# Altium schematic sheet smt preamp with charge or INV stages with input resistors.SchDoc
size A; SheetNumber: 2; SheetTotal: 2
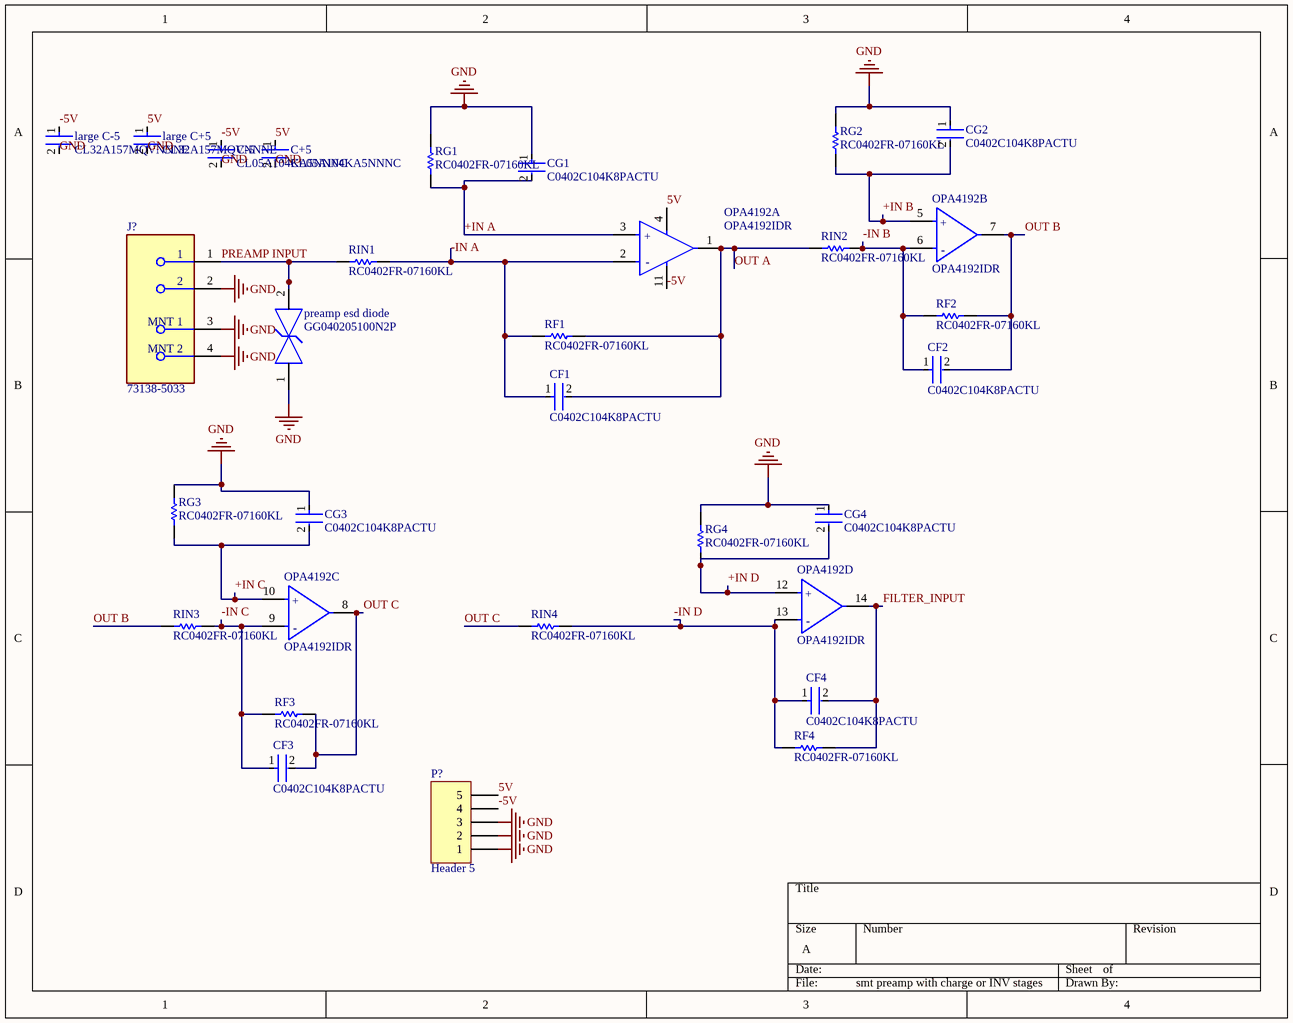
[diagram p0: smt preamp with charge or INV stages with input resistors.SchDoc]

## Parts
C+5  CL05A104KA5NNNC  [FP-CL278-IPC_C]
C-5  CL05A104KA5NNNC  [FP-CL278-IPC_C]
CF1  C0402C104K8PACTU  [FP-C0402-BB-MFG]
CF2  C0402C104K8PACTU  [FP-C0402-BB-MFG]
CF3  C0402C104K8PACTU  [FP-C0402-BB-MFG]
CF4  C0402C104K8PACTU  [FP-C0402-BB-MFG]
CG1  C0402C104K8PACTU  [FP-C0402-BB-MFG]
CG2  C0402C104K8PACTU  [FP-C0402-BB-MFG]
CG3  C0402C104K8PACTU  [FP-C0402-BB-MFG]
CG4  C0402C104K8PACTU  [FP-C0402-BB-MFG]
J?  73138-5033  [FP-73138-5033-MFG]
large_C+5  CL32A157MQVNNNE  [FP-CL32-IPC_C]
large_C-5  CL32A157MQVNNNE  [FP-CL32-IPC_C]
OPA4192  OPA4192IDR  [FP-D0014A-IPC_C]  (parts A,B,C,D of 4)
P?  Header 5  [HDR1X5]
preamp_esd_diode  GG040205100N2P  [FP-GG0402-MFG]
RF1  RC0402FR-07160KL  [RESC1005X40X25NL05T10]
RF2  RC0402FR-07160KL  [RESC1005X40X25NL05T10]
RF3  RC0402FR-07160KL  [RESC1005X40X25NL05T10]
RF4  RC0402FR-07160KL  [RESC1005X40X25NL05T10]
RG1  RC0402FR-07160KL  [RESC1005X40X25NL05T10]
RG2  RC0402FR-07160KL  [RESC1005X40X25NL05T10]
RG3  RC0402FR-07160KL  [RESC1005X40X25NL05T10]
RG4  RC0402FR-07160KL  [RESC1005X40X25NL05T10]
RIN1  RC0402FR-07160KL  [RESC1005X40X25NL05T10]
RIN2  RC0402FR-07160KL  [RESC1005X40X25NL05T10]
RIN3  RC0402FR-07160KL  [RESC1005X40X25NL05T10]
RIN4  RC0402FR-07160KL  [RESC1005X40X25NL05T10]

## Nets
GND: C+5.2 C-5.2 CG1.1 CG2.1 CG3.1 CG4.1 J?.2 J?.3(MNT_1) J?.4(MNT_2) large_C+5.2 large_C-5.2 P?.1 P?.2 P?.3 preamp_esd_diode.1(IO_1) RG1.2 RG2.2 RG3.2 RG4.2
5V: C+5.1 large_C+5.1 OPA4192.4(V+) P?.5
+IN A: CG1.2 OPA4192.3(+IN_A) RG1.1
+IN B: CG2.2 OPA4192.5(+IN_B) RG2.1
+IN C: CG3.2 OPA4192.10(+IN_C) RG3.1
+IN D: CG4.2 OPA4192.12(+IN_D) RG4.1
-5V: C-5.1 large_C-5.1 OPA4192.11(V-) P?.4
-IN A: CF1.1 OPA4192.2(-IN_A) RF1.1 RIN1.2
-IN B: CF2.1 OPA4192.6(-IN_B) RF2.1 RIN2.2
-IN C: CF3.1 OPA4192.9(-IN_C) RF3.1 RIN3.2
-IN D: CF4.1 OPA4192.13(-IN_D) RF4.1 RIN4.2
FILTER_INPUT: CF4.2 OPA4192.14(OUT_D) RF4.2
OUT A: CF1.2 OPA4192.1(OUT_A) RF1.2 RIN2.1
OUT B: CF2.2 OPA4192.7(OUT_B) RF2.2 RIN3.1
OUT C: CF3.2 OPA4192.8(OUT_C) RF3.2 RIN4.1
PREAMP INPUT: J?.1 preamp_esd_diode.2(IO_2) RIN1.1

## Notes on the sheet
- (in symbol CMP-04895-000275-1, part A) +; -
- (in symbol CMP-04895-000275-1, part B) +; -
- (in symbol CMP-04895-000275-1, part C) +; -
- (in symbol CMP-04895-000275-1, part D) +; -

## Library data of the parts
C+5 C-5 = CMP-13271-000728-1: Cap Ceramic 100nF 25V X5R ±10% SMD 0402 +85°C Paper T/R; Package Quantity: 1; Height: 0.5mm; Case Code (Metric): 1005; Thickness: 0.022inch; Mount: Surface Mount; Lead Free: Lead Free; Case Code (Imperial): 0402; Packaging: Tape and Reel; Depth: 0.5mm; Voltage: 25V; Min Operating Temperature: -55°C; Voltage Rating: 25V; Dielectric: X5R; Case/Package: 0402; Tolerance: 10%; Width: 0.02inch; Max Operating Temperature: 85°C; Capacitance: 100nF; Length: 1mm; Radiation Hardening: No; Voltage Rating (DC): 25V
CF1-CF4 CG1-CG4 = CMP-2008-02046-2: CAP CER 0.1UF 10V X5R 0402; Manufacturer: Kemet; Capacitance: 0.10 μF; Temperature Coefficient: 15%; Tolerance: 0.1; Value: 0.10 μF; Material: Ceramic; Package: C0402-BB; Temperature: -55°C to +125°C; ComponentLink2Description: Datasheet; Temperature Characteristic: X5R; Device Class L1: Passive Components; Height: 0.55mm; Lead Free: Yes; ComponentLink2URL: https://content.kemet.com/datasheets/KEM_C1002_X7R_SMD.pdf; Device Class L2: Capacitors; Temperature Range Low: -55°C; Temperature Range High: +125°C; RoHS: TRUE; Octopart: https://octopart.com/c0402c104k8pactu-kemet-140039; Automotive: No; Mouser Description: Capacitor 100 nF 10 VDC 0402; Category: Cap; Voltage Rating: 10 V; Digikey Description: CAP CER 0.1UF 10V X5R 0402; Ipc Land Pattern Name: CAPC10050X50; Device Class L3: Ceramic Capacitors; Manufacturer Part Number: C0402C104K8PACTU
J? = CMP-00257-00776601-1: 73138-5033 RF BNC Connector, Female, Panel Mount, Board And Panel Mount, Solder Terminal, Receptacle; Manufacturer Lifecycle Status: ACTIVE; NexarPartId: 776601; Connector Type: BNC, Receptacle, Socket; Body Material: Zinc; Body Plating: Nickel; Dielectric Material: PP; Impedance: 50Ω; Frequency: 2GHz; Packaging: Bulk; Insulation Material: Polypropylene; Housing Color: Silver; Termination: Solder; Length: 35.43mm; Country of Origin: US; Gender: Female; Fastening Type: Bayonet; RoHS: Compliant; Radiation Hardening: No; Contact Plating: Gold; Orientation: Right Angle; Contact Material: Bronze; Lead Free: Lead Free; Mount: Through Hole; Lifecycle Status: Production; Depth: 14.66mm
large_C+5 large_C-5 = CMP-2000-06109-2: Cap Ceramic 150uF 6.3V X5R ±20% SMD 1210 +85°C Embossed T/R; Width: 0.098inch; Case Code (Metric): 3225; Capacitance: 150uF; Case/Package: 1210; Package Quantity: 1; Voltage Rating (DC): 6.3V; Mount: Surface Mount; Packaging: Tape and Reel; Max Operating Temperature: 85°C; Case Code (Imperial): 1210; Tolerance: 20%; Length: 0.126inch; Thickness: 0.11inch; Min Operating Temperature: -55°C; Voltage Rating: 6.3V; Lead Free: Lead Free
OPA4192 = CMP-04895-000275-1: IC OPAMP GP 4 CIRCUIT 14SOIC; Input Offset Voltage (Vos): 5uV; Max Supply Voltage: 36V; Operating Supply Current: 1mA; Number of Circuits: 1; Input Bias Current: 5pA; Max Dual Supply Voltage: 18V; Gain Bandwidth Product: 10MHz; Output Current per Channel: 65mA; Min Supply Voltage: 4.5V; Common Mode Rejection Ratio: 100dB; Voltage Gain: 140dB; Number of Channels: 4; Slew Rate: 20V/µs; Min Dual Supply Voltage: 2.25V; Max Operating Temperature: 125°C; Packaging: Tape and Reel; Lead Free: Lead Free; RoHS Compliant: Yes; Number of Pins: 14; Case/Package: SOIC; Mount: Surface Mount; Min Operating Temperature: -40°C
P? = Header 5: Header, 5-Pin; LatestRevisionDate: 17-Jul-2002; LatestRevisionNote: Re-released for DXP Platform.; Publisher: Altium Limited
preamp_esd_diode = CMP-04587-000001-1: TVS DIODE 5V 12V 0402; Manufacturer: AVX Corporation; Number Of Channels: 1; Peak Pulse Current: 16A; Capacitance: 10pF; Direction: Bidirectional; Value: 10pF; Breakdown Voltage: 5.5V; Peak Pulse Power: 96W; Automotive: No; ComponentLink2URL: http://datasheets.avx.com/AVX-GiGuard.pdf; Manufacturer Part Number: GG040205100N2P; Lead Free: Yes; Device Class L2: TVS Diodes; Temperature: -55°C to +125°C; Category: Diode; Reverse Standoff Voltage: 5V; Octopart: https://octopart.com/gg040205100n2p-avx-81066081; Clamping Voltage: 12V; Ipc Land Pattern Name: DIOC10060X50; Digikey Description: TVS DIODE 5V 12V 0402; Device Class L3: unset; ComponentLink2Description: Datasheet; Temperature Range Low: -55°C; Temperature Range High: +125°C; Device Class L1: Circuit Protection; Height: 0.55mm; Package: GG0402; RoHS: TRUE
RF1-RF4 RG1-RG4 RIN1-RIN4 = CMP-2002-07080-1: Manufacturer: Yageo / Phycomp; Part Number: RC0402FR-07160KL